# Altium schematic sheet test.SchDoc
size A4
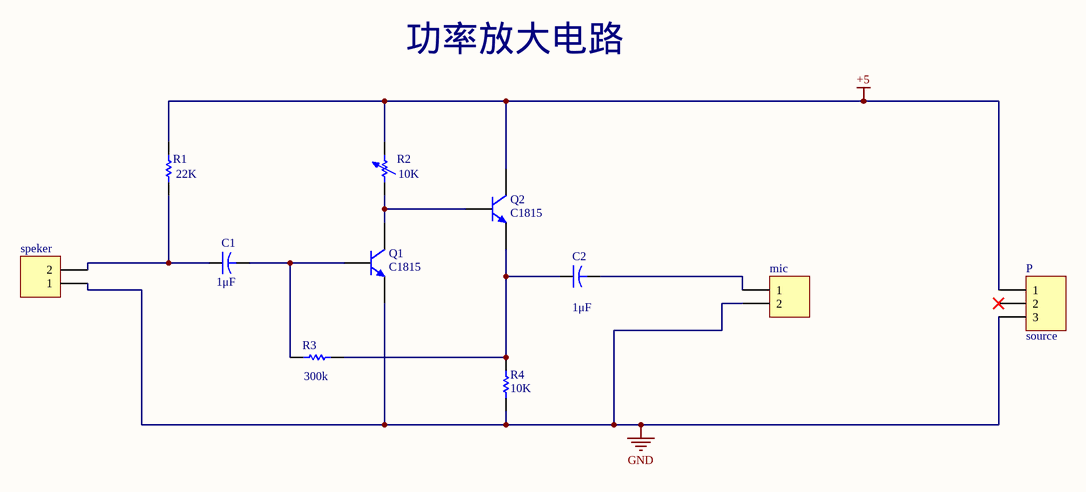
[diagram p0: test.SchDoc]

## Parts
C1  value 1μF  [CAPR5-4X5]  (hidden comment: Cap2)
C2  value 1μF  [CAPR5-4X5]  (hidden comment: Cap2)
mic  MHDR1X2  [MHDR1X2]  (value not drawn)
P  source  [MHDR1X3]
Q1  C1815  [TO-92A]
Q2  C1815  [TO-92A]
R1  value 22K  [AXIAL-0.3]  (hidden comment: Res1)
R2  value 10K  [AXIAL-0.7]  (hidden comment: Res Adj1)
R3  value 300k  [AXIAL-0.3]  (hidden comment: Res1)
R4  value 10K  [AXIAL-0.3]  (hidden comment: Res1)
speker  MHDR1X2  [MHDR1X2]  (value not drawn)

## Nets
+5: P.1 Q2.3(C) R1.1 R2.2
GND: mic.2 P.3 Q1.1(E) R4.1 speker.1
NetC1_1: C1.1 R1.2 speker.2
NetC1_2: C1.2 Q1.2(B) R3.1
NetC2_1: C2.1 Q2.1(E) R3.2 R4.2
NetC2_2: C2.2 mic.1
NetQ1_3: Q1.3(C) Q2.2(B) R2.1

Not connected (* = marked no-connect by the designer): P 2*

## Notes on the sheet
- 功率放大电路

## Library data of the parts
C1 C2 = Cap2: Capacitor; Published: 23-Sep-2002; PackageReference: CAPR5-4X5; Publisher: Altium Limited; PackageDescription: Capacitor; 2 Leads
mic speker = MHDR1X2: Header, 2-Pin; LatestRevisionDate: 17-Jul-2002; LatestRevisionNote: Re-released for DXP Platform.; Publisher: Altium Limited
P = MHDR1X3: Header, 3-Pin; LatestRevisionDate: 17-Jul-2002; LatestRevisionNote: Re-released for DXP Platform.; Publisher: Altium Limited
Q1 Q2 = 2N3904: NPN General Purpose Amplifier; Published: 8-Jun-2000; LatestRevisionDate: 15-Jan-2003; LatestRevisionNote: PCB Footprint 'BCY-W3/D4.7' replaced; DatasheetVersion: 1997; PackageVersion: Sep-1998; PackageReference: TO-92A; Publisher: Altium Limited; PackageDescription: TO, Flat Index; 3 In-Line, Axial Leads; Body Dia. 4.5mm; Leads 0.51 x 0.48 mm (max); ComponentLink1Description: Manufacturer Link; ComponentLink1URL: http://www.fairchildsemi.com/; ComponentLink2Description: Datasheet; ComponentLink2URL: http://www.fairchildsemi.com/ds/2N%2F2N3904.pdf
R1 R3 R4 = Res1: Resistor; Published: 8-Jun-2000; LatestRevisionDate: 17-Jul-2002; LatestRevisionNote: Re-released for DXP Platform.; PackageReference: AXIAL-0.3; Publisher: Altium Limited; PackageDescription: Axial Device, Thru-Hole; 2 Leads; 0.3 in Pin Spacing
R2 = Res Adj1: Variable Resistor; Set Position: 0.5; Published: 8-Jun-2000; LatestRevisionDate: 17-Jul-2002; LatestRevisionNote: Re-released for DXP Platform.; PackageReference: AXIAL-0.7; Publisher: Altium Limited; PackageDescription: Axial Device, Thru-Hole; 2 Leads; 0.7 in Pin Spacing